# Altium schematic sheet Power_Delivery.SchDoc
size A3; SheetNumber: 4; SheetTotal: 9
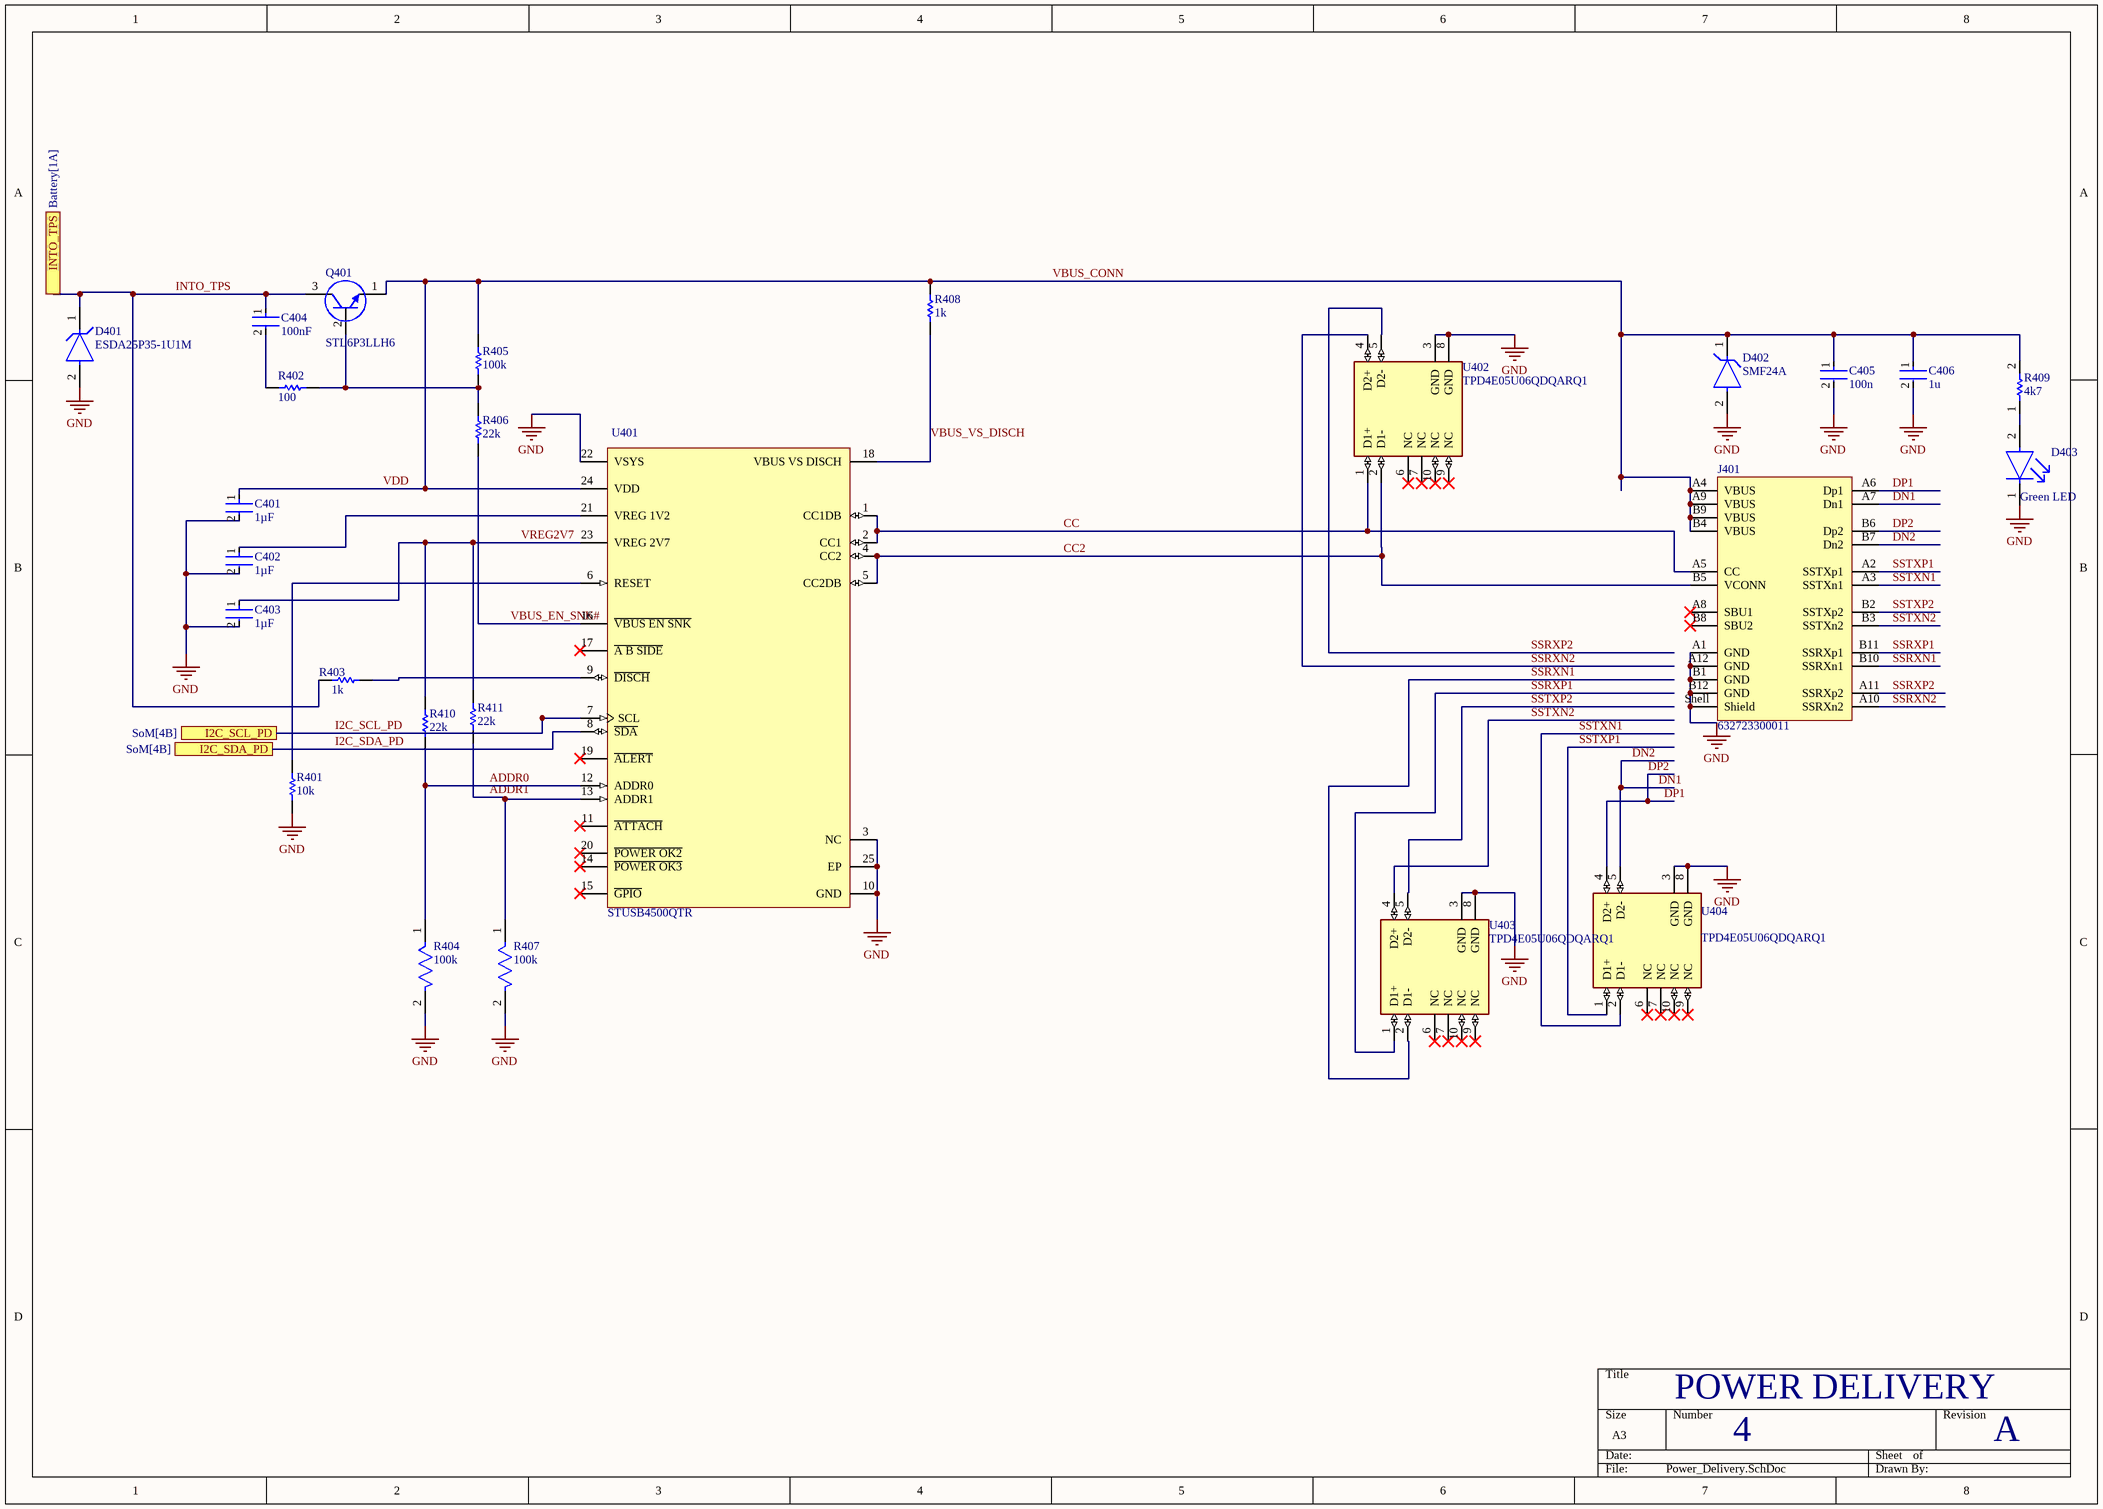
[diagram p0: Power_Delivery.SchDoc]

## Parts
C401  1µF  [FP-GRM15-0_1-MFG]
C402  1µF  [FP-GRM15-0_1-MFG]
C403  1µF  [FP-GRM15-0_1-MFG]
C404  100nF  [FP-GRM155-0_05-IPC_B]
C405  100n  [FP-GRM155-0_05-IPC_B]
C406  1u  [FP-GRM155-0_1-IPC_C]
D401  ESDA25P35-1U1M  [FP-QFN_1610-MFG]
D402  SMF24A  [FP-SMF24A-MFG]
D403  Green LED  [FP-LTST-C190GKT-MFG]
J401  632723300011  [632723300011]
Q401  STL6P3LLH6  [TRANS_STL6P3LLH6]
R401  10k  [RESC1005X40X25LL05T10]
R402  100  [RESC1005X40X25ML05T10]
R403  1k  [RESC3216X60X45ML15T20]
R404  100k  [FP-RC0402-0_4-IPC_A]
R405  100k  [RESC1005X40X25NL05T10]
R406  22k  [RESC1005X40X25NL05T05]
R407  100k  [FP-RC0402-0_4-IPC_A]
R408  1k  [RESC3216X60X45ML15T20]
R409  4k7  [RESC1005X40X25NL10T10]
R410  22k  [RESC1005X40X25NL05T10]
R411  22k  [RESC1005X40X25NL05T10]
U401  STUSB4500QTR  [FP-QFN-24-EP_4x4-MFG]
U402  TPD4E05U06QDQARQ1  [FP-DQA0010A-MFG]
U403  TPD4E05U06QDQARQ1  [FP-DQA0010A-MFG]
U404  TPD4E05U06QDQARQ1  [FP-DQA0010A-MFG]

## Ports
I2C_SCL_PD (see SoM[4B]), I2C_SDA_PD (see SoM[4B]), INTO_TPS (see Battery[1A])

## Nets
GND: C401.2 C402.2 C403.2 C405.2 C406.2 D401.2(A) D402.2(A) D403.1(C) J401.A1(GND) J401.A12(GND) J401.B1(GND) J401.B12(GND) J401.Shell(Shield) R401.1 R404.2 R407.2 U401.3(NC) U401.10(GND) U401.22(VSYS) U401.25(EP) U402.3(GND) U402.8(GND) U403.3(GND) U403.8(GND) U404.3(GND) U404.8(GND)
ADDR0: R404.1 R410.1 U401.12(ADDR0)
ADDR1: R407.1 R411.1 U401.13(ADDR1)
CC: J401.A5(CC) U401.1(CC1DB) U401.2(CC1) U402.1(D1+)
CC2: J401.B5(VCONN) U401.4(CC2) U401.5(CC2DB) U402.2(D1-)
DN1: J401.A7(Dn1) J401.B7(Dn2) U404.5(D2-)  [also labelled DN2]
DP1: J401.A6(Dp1) J401.B6(Dp2) U404.4(D2+)  [also labelled DP2]
I2C_SCL_PD: U401.7(SCL) ; port I2C_SCL_PD
I2C_SDA_PD: U401.8(~{SDA}) ; port I2C_SDA_PD
INTO_TPS: C404.1 D401.1(C) Q401.3(C) R403.2 ; port INTO_TPS
SSRXN1: J401.B10(SSRXn1) U403.2(D1-)
SSRXN2: J401.A10(SSRXn2) U402.4(D2+)
SSRXP1: J401.B11(SSRXp1) U403.1(D1+)
SSRXP2: J401.A11(SSRXp2) U402.5(D2-)
SSTXN1: J401.A3(SSTXn1) U404.2(D1-)
SSTXN2: J401.B3(SSTXn2) U403.4(D2+)
SSTXP1: J401.A2(SSTXp1) U404.1(D1+)
SSTXP2: J401.B2(SSTXp2) U403.5(D2-)
VBUS_CONN: C401.1 C405.1 C406.1 D402.1(C) J401.A4(VBUS) J401.A9(VBUS) J401.B4(VBUS) J401.B9(VBUS) Q401.1(E) R405.2 R408.2 R409.2 U401.24(VDD)  [also labelled VDD]
VBUS_EN_SNK#: R406.1 U401.16(~{VBUS_EN_SNK})
VBUS_VS_DISCH: R408.1 U401.18(VBUS_VS_DISCH)
VREG2V7: C403.1 R410.2 R411.2 U401.23(VREG_2V7)
NetC402_1: C402.1 U401.21(VREG_1V2)
NetC404_2: C404.2 R402.1
NetD403_2: D403.2(A) R409.1
NetQ401_2: Q401.2(B) R402.2 R405.1 R406.2
NetR401_2: R401.2 U401.6(RESET)
NetR403_1: R403.1 U401.9(~{DISCH})

Not connected (* = marked no-connect by the designer): J401 A8(SBU1)* B8(SBU2)*; U401 11(~{ATTACH})* 14(~{POWER_OK3})* 15(~{GPIO})* 17(~{A_B_SIDE})* 19(~{ALERT})* 20(~{POWER_OK2})*; U402 6(NC)* 7(NC)* 9(NC)* 10(NC)*; U403 6(NC)* 7(NC)* 9(NC)* 10(NC)*; U404 6(NC)* 7(NC)* 9(NC)* 10(NC)*

## Notes on the sheet
- POWER DELIVERY
- 4
- A

## Library data of the parts
C401-C403 = CMP-2008-04556-2: CAP CER 1UF 10V X5R 0402; Manufacturer Part Number: GRM155R61A105KE15D; Manufacturer: Murata; Material: Ceramic; Tolerance: 10%; Temperature Coefficient: 15%; Octopart: https://octopart.com/grm155r61a105ke15d-murata-197442; Lead Free: Yes; ComponentLink2Description: Datasheet; Temperature: -55°C to +85°C; Temperature Range High: +85°C; Height: 0.55mm; Capacitance: 1uF; Ipc Land Pattern Name: CAPC10050X50; ComponentLink2URL: https://search.murata.co.jp/Ceramy/image/img/A01X/G101/ENG/GRM155R61A105KE15-01A.pdf; Temperature Range Low: -55°C; Device Class L2: Capacitors; Voltage Rating: 10V; RoHS: TRUE; Device Class L1: Passive Components; Device Class L3: Ceramic Capacitors; Temperature Characteristic: X5R; Mouser Description: 0402 1 uF 10 V ±10% Tolerance X5R Surface Mount Multilayer Ceramic Capacitor; Automotive: No; Package: GRM15-0.1; Digikey Description: CAP CER 1UF 10V X5R 0402; Value: 1uF; Category: Cap
C404 = CMP-2008-04639-2: Chip Multilayer Ceramic Capacitors for General Purpose, 0402, 0.10uF, X7R, 15%, 10%, 50V; Dissipation Factor: 0.025%; Weight: 0.000212oz; Thickness: 0.022inch; Voltage Rating (DC): 50V; Dielectric Material: Ceramic; Termination: SMD/SMT; Case/Package: 0402; Case Code (Imperial): 0402; Mount: Surface Mount; REACH SVHC: No SVHC; Resistor Type: Ceramic; Dielectric: X7R; Max Operating Temperature: 125°C; Voltage: 50V; Lead Free: Lead Free; Package Quantity: 10000; Packaging: Tape and Reel; Capacitance: 100nF; Length: 1mm; Material: Ceramic; Height: 0.5mm; Depth: 0.5mm; Width: 0.5mm; Min Operating Temperature: -55°C; Tolerance: 10%; Case Code (Metric): 1005; Voltage Rating: 50V
C405 = CMP-06035-003982-1: Chip Multilayer Ceramic Capacitors for General Purpose, 0402, 0.10uF, X5R, 15%, 10%, 50V; Dissipation Factor: 0.025%; Capacitance: 100nF; Resistor Type: Ceramic; Max Operating Temperature: 85°C; Dielectric Material: Ceramic; Voltage Rating: 50V; Voltage Rating (DC): 50V; REACH SVHC: No SVHC; Case/Package: 0402; Voltage: 50V; Mount: Surface Mount; Case Code (Imperial): 0402; Length: 1mm; Packaging: Tape and Reel; Dielectric: X5R; Lead Free: Lead Free; Weight: 0.000212oz; Package Quantity: 10000; Termination: SMD/SMT; Depth: 0.5mm; Width: 0.02inch; Height: 0.5mm; Min Operating Temperature: -55°C; Case Code (Metric): 1005; Tolerance: 10%; Thickness: 0.022inch
C406 = CMP-06035-026280-1: Chip Multilayer Ceramic Capacitors for General Purpose, 0402, 1.0uF, X5R, 15%, 10%, 25V; Capacitance: 1uF; Voltage Rating (DC): 25V; Width: 500um; Thickness: 500um; Length: 1mm; Tolerance: 10%; Dielectric: X5R
D401 = CMP-12225-000030-1: TVS DIODE 22V 41V 1610; Manufacturer: STMicroelectronics; Clamping Voltage: 39V; Breakdown Voltage: 23.3V; Max Junction Temp: +150°C; Peak Pulse Current: 35A; Number Of Channels: 1; Peak Pulse Power: 1400W; Standoff Height: 0.02mm; Direction: Unidirectional; ComponentLink2URL: https://www.st.com/resource/en/datasheet/esda25p35-1u1m.pdf; Height: 0.6mm; Device Class L2: TVS Diodes; Temperature: -55°C to +150°C; Category: Diode; Temperature Range Low: -55°C; Digikey Description: TVS DIODE 22V 41V 1610; Reverse Standoff Voltage: 22V; Lead Free: Yes; Automotive: No; RoHS: TRUE; Manufacturer Part Number: ESDA25P35-1U1M; Temperature Range High: +150°C; Package: QFN_1610; Device Class L1: Circuit Protection; Device Class L3: unset; ComponentLink2Description: Datasheet; Octopart: https://octopart.com/esda25p35-1u1m-stmicroelectronics-75302699; Mouser Description: ESDA Series 1400 W 25 V Uni-Directional Surface Mount TVS Diode - QFN-1610
D402 = CMP-08607-000108-1: TVS DIODE 24V 38.9V SOD123F; Breakdown Voltage: 29.5V; Number of Unidirectional Channels: 1; Power Line Protection: No; Peak Pulse Power: 200W; Polarity: Unidirectional; Reverse Breakdown Voltage: 26.7V; Test Current: 1mA; Leakage Current: 1uA; Max Surge Current: 5.1A; Packaging: Tape and Reel; Min Operating Temperature: -55°C; Number of Channels: 1; Composition: Zener; Clamping Voltage: 38.9V; Termination: SMD/SMT; Max Breakdown Voltage: 29.5V; Reverse Standoff Voltage: 24V; Mount: Surface Mount; Number of Pins: 2; Min Breakdown Voltage: 26.7V; Peak Pulse Current: 5.1A; Max Operating Temperature: 150°C; Number of Elements: 1; Lead Free: Lead Free
D403 = CMP-22017-000005-2: LED GREEN CLEAR CHIP SMD; Dominant Wavelength: 569nm; Reverse Voltage: 5V; Lens Color: Colorless; Viewing Angle: 130°; Voltage: 2V; Forward Current: 30mA; Power Dissipation: 100mW; Luminous Intensity: 6mcd; Number of LEDs: 1; Forward Voltage: 2.1V; Wavelength: 565nm; Test Current: 10mA; Min Operating Temperature: -55°C; Lens Style: Clear; Mount: Surface Mount; Width: 0.8mm; Packaging: Tape and Reel; Lens Transparency: Clear; Case Code (Metric): 1608; Depth: 0.8mm; Case Code (Imperial): 0603; Case/Package: 0603; Number of Pins: 2; Max Operating Temperature: 85°C; Lead Free: Lead Free; Number of Elements: 1; Length: 1.6mm; Height: 0.8mm; Package Quantity: 1; Power Rating: 100mW; Radiation Hardening: No; Illumination Color: Green; Color: Green
J401 = CMP-002-00072-1: Conn USB 3.1 Type C RCP 24 POS 0.5mm/0.4mm Solder RA SMD/Thru-Hole 24 Terminal 1 Port T/R; Gender: Receptacle; Voltage Rating: 20V; Pins: 24; Min Operating Temperature: -40°C; Max Operating Temperature: 105°C; Mounting Technology: Surface Mount, Through Hole; Connector Type: USB
Q401 = CMP-013-00034-1: P-channel 30 V, 0.024 Ohm typ., 6 A STripFET H6 Power MOSFET in a PowerFLAT 3.3 x 3.3 package; Pins: 8; Max Operating Temperature: 150°C; Mounting Technology: Surface Mount
R401 = CMP-2002-07353-1: Part Number: RC0402FR-0710KL; Manufacturer: Yageo / Phycomp
R402 = CMP-2002-07344-1: Part Number: RC0402FR-07100RL; Manufacturer: Yageo / Phycomp
R403 R408 = CMP-2100-03616-1: Chip Resistor, 1 KOhm, +/- 1%, 0.25 W, -55 to 155 degC, 1206 (3216 Metric), RoHS, Tape and Reel; Manufacturer: Vishay Semiconductor; Power Rating: 250mW; Voltage Rating (DC): 200V; Resistance: 1KOhm; Temperature Coefficient: 100ppm/degreesC; Case Code (Imperial): 1206; Length: 3.2mm; Case/Package: 1206; Contact Plating: Tin; Package Quantity: 10; Datasheet URL: http://www.farnell.com/datasheets/1720486.pdf; Mount: SurfaceMount; Package Description: 2-Pin Surface Mount Device, Body 3.15 x 1.6 mm; Package Reference: 1206.0; Max Operating Temperature: 155degC; Lead Free: LeadFree; Weight: 0.000353oz; Military Standard: Not; Max Power Dissipation: 250mW; Case Code (Metric): 3216; Number of Terminations: 2; Tolerance: 1%; Width: 0.063inch; Termination: SMD/SMT; Number of Pins: 2; Min Operating Temperature: -55degC; Height: 0.55mm; Depth: 1.6mm; RoHSCompliant: true; Composition: ThickFilm; Packaging: TapeandReel; Manufacturer URL: http://www.vishay.com/; Voltage Rating: 200V; Radiation Hardening: No; REACH SVHC: Unknown; Datasheet Version: 41061.0
R404 R407 = CMP-2002-07913-2: RES 100K OHM 5% 1/16W 0402; Temperature Coefficient: 100ppm/°C; Max Power Dissipation: 63mW; Resistance: 100kR; Voltage Rating: 50V; Tolerance: 5%; Packaging: Tape and Reel; Termination: SMD/SMT; Case Code (Metric): 1005; Length: 1mm; Power Rating: 63mW; Min Operating Temperature: -55°C; Case/Package: 0402; Construction: Rectangular; Series: RC; Resistance Tolerance: 5%; Height: 0.016inch; Case Code (Imperial): 0402; RoHS Compliant: Yes; Size Code: 0402; Number of Terminations: 2; Features: Moisture Resistant; Width: 0.02inch; Max Operating Temperature: 155°C; Military Standard: Not; Lead Free: Lead Free; Depth: 0.5mm; Package Quantity: 1; Resistor Type: Thick Film
R405 = CMP-2002-07343-1: Part Number: RC0402FR-07100KL; Manufacturer: Yageo / Phycomp
R406 = CMP-1011-00659-2: Part Number: CRCW040222K0FKED; Manufacturer: Vishay Dale
R409 = CMP-2002-05217-1: Manufacturer: Bourns; Part Number: CR0402-FX-4701GLF
R410 R411 = CMP-2002-07517-1: Manufacturer: Yageo / Phycomp; Part Number: RC0402FR-0722KL
U401 = CMP-12113-000003-3: 4.1V~22V USB 2.0 I2C Controllers Interface ICs STUSB45 Controller 24-VFQFN Exposed Pad; Number of Ports: 1; Min Supply Voltage: 3V; Max Junction Temperature (Tj): 145°C; Max Supply Voltage: 22V; Interface: I2C, USB; USB Standard: USB 2.0; Lifecycle Status: Production; Schedule B: 8542390000, 8542390000; Min Operating Temperature: -40°C; Ambient Temperature Range High: 105°C; Max Operating Temperature: 105°C; Height: 1mm
U402-U404 = CMP-04985-000004-1: TVS DIODE 5.5V 14V 10USON; Manufacturer: Texas Instruments; Direction: Unidirectional; Standoff Height: 0mm; Capacitance: 0.5pF; Number Of Channels: 4; Breakdown Voltage: 6.4V; Peak Pulse Power: 2.5W; Automotive Grade: Grade 1; Value: 0.5pF; Interface: USB,Ethernet,LVDS,Other; Peak Pulse Current: 2.5A; Operating Supply Voltage: 5.5V; Reverse Standoff Voltage: 5.5V; Package: DQA0010A; Temperature Range Low: -40°C; Temperature Range High: +125°C; Ambient Temperature Range Low: -40°C; Device Class L1: Circuit Protection; Clamping Voltage: 14V; Manufacturer Part Number: TPD4E05U06QDQARQ1; Device Class L2: ESD and Circuit Protection ICs; Octopart: https://octopart.com/tpd4e05u06qdqarq1-texas+instruments-48523459; Device Class L3: unset; Height: 0.55mm; Automotive: Yes; ComponentLink2Description: Datasheet; RoHS: TRUE; Ambient Temperature Range High: +125°C; Category: IC; Mouser Description: Automotive 4-Channel ESD Protection Solution for SuperSpeed (up to 5 Gbps) Interface 10-USON -40 to 125; Temperature: -40°C to +125°C; ComponentLink2URL: http://www.ti.com/lit/ds/symlink/tpd4e05u06-q1.pdf; Digikey Description: TVS DIODE 5.5V 14V 10USON; Lead Free: Yes